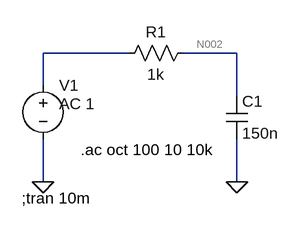
[diagram p0: schematic RC.asc]
RC.asc, the LTspice schematic file:
Version 4
SHEET 1 880 680
WIRE 176 128 48 128
WIRE 336 128 256 128
WIRE 48 176 48 128
WIRE 336 192 336 128
WIRE 48 320 48 256
WIRE 336 320 336 256
FLAG 48 320 0
FLAG 336 320 0
SYMBOL voltage 48 160 R0
WINDOW 3 24 96 Invisible 2
WINDOW 123 24 44 Left 2
WINDOW 39 0 0 Left 0
SYMATTR Value PULSE(0 1 0 1p 1p 3.75m 7.5m)
SYMATTR Value2 AC 1
SYMATTR InstName V1
SYMBOL res 272 112 R90
WINDOW 0 0 56 VBottom 2
WINDOW 3 32 56 VTop 2
SYMATTR InstName R1
SYMATTR Value 1k
SYMBOL cap 320 192 R0
SYMATTR InstName C1
SYMATTR Value 150n
TEXT 16 344 Left 2 !;tran 10m
TEXT 104 272 Left 2 !.ac oct 100 10 10k

The netlist it stands for:
* RC.asc
V1 N001 0 PULSE(0 1 0 1p 1p 3.75m 7.5m) AC 1
R1 N002 N001 1k
C1 N002 0 150n
;tran 10m
.ac oct 100 10 10k
.backanno
.end

* Results of the author's LTspice run, read from the files saved beside the schematic
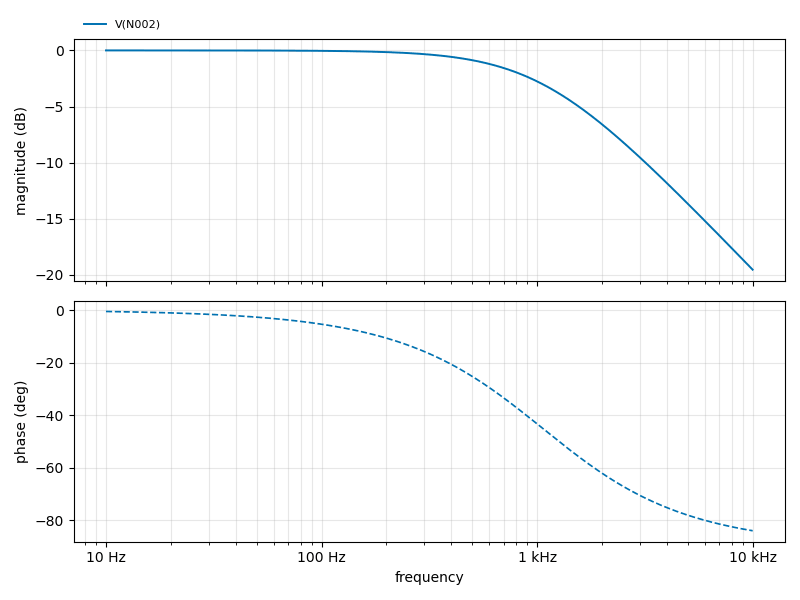
[diagram p1: AC Analysis of RC.asc, plotted from the saved traces]
* AC Analysis, 1 run:
*   V(N002): -0.00 dB at 10 Hz, -19.53 dB at 10 kHz, peak -0.00 dB at 10 Hz, 3 dB below the peak at 1.061 kHz